# EAGLE design W706 (EAGLE 6.6.0)
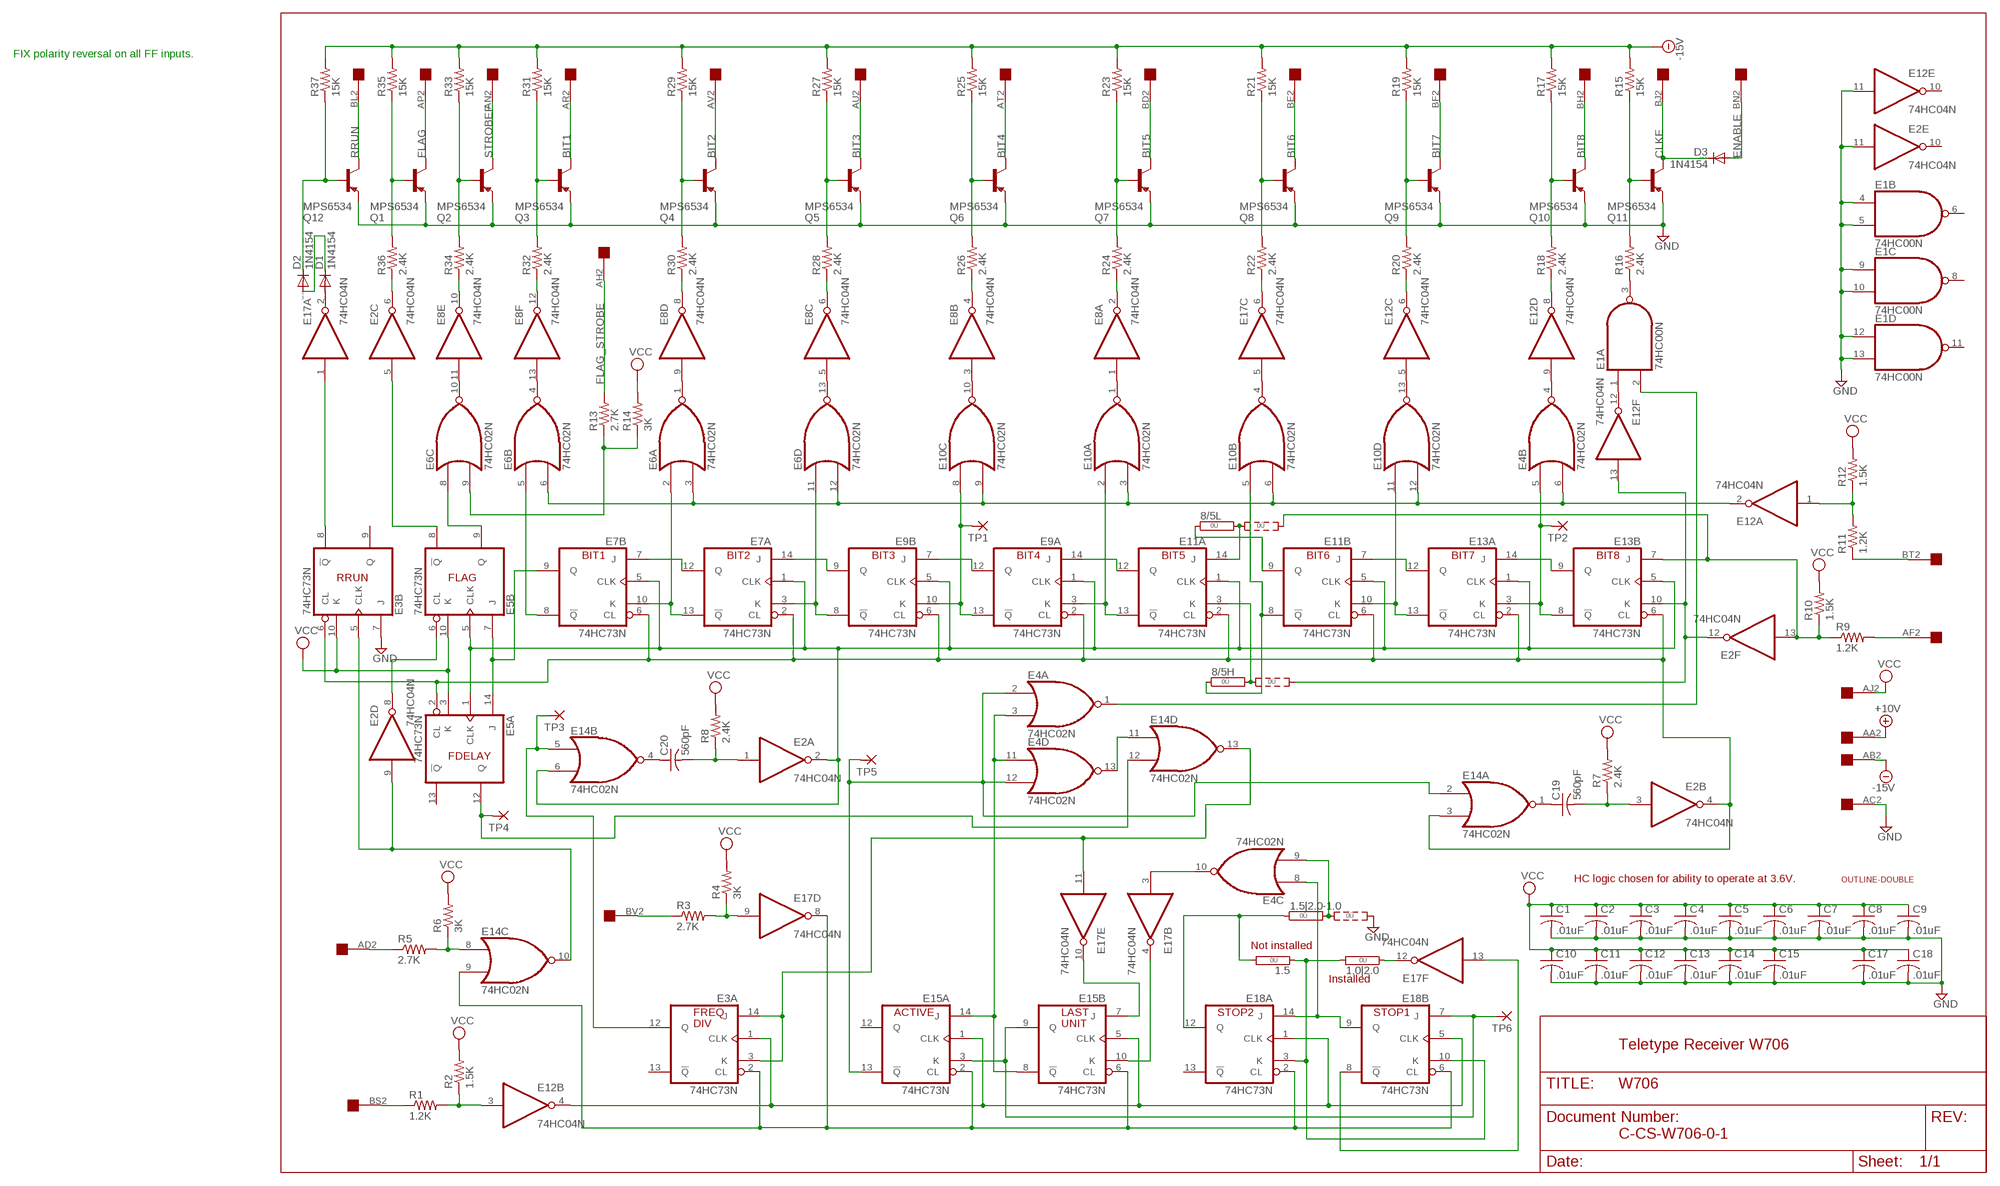
[diagram p0: schematic, sheet 1]

## Parts
1.0|2.0  0R  [0R/10]
1.5  0R  [0R/10]
1.5|2.0-1.0  0R2  [0R2/10]
8/5H  0R2  [0R2/10]
8/5L  0R2  [0R2/10]
C1  .01uF  C-US050-025X075  [C050-025X075]
C2  .01uF  C-US050-025X075  [C050-025X075]
C3  .01uF  C-US050-025X075  [C050-025X075]
C4  .01uF  C-US050-025X075  [C050-025X075]
C5  .01uF  C-US050-025X075  [C050-025X075]
C6  .01uF  C-US050-025X075  [C050-025X075]
C7  .01uF  C-US050-025X075  [C050-025X075]
C8  .01uF  C-US050-025X075  [C050-025X075]
C9  .01uF  C-US050-025X075  [C050-025X075]
C10  .01uF  C-US050-025X075  [C050-025X075]
C11  .01uF  C-US050-025X075  [C050-025X075]
C12  .01uF  C-US050-025X075  [C050-025X075]
C13  .01uF  C-US050-025X075  [C050-025X075]
C14  .01uF  C-US050-025X075  [C050-025X075]
C15  .01uF  C-US050-025X075  [C050-025X075]
C17  .01uF  C-US050-025X075  [C050-025X075]
C18  .01uF  C-US050-025X075  [C050-025X075]
C19  560pF  C-US050-025X075  [C050-025X075]
C20  560pF  C-US050-025X075  [C050-025X075]
D1  1N4154  1N4148DO35-10  [DO35-10]
D2  1N4154  1N4148DO35-10  [DO35-10]
D3  1N4154  1N4148DO35-10  [DO35-10]
E1  74HC00N  74LS00N  [DIL14]
E2  74HC04N  74LS04N  [DIL14]
E3  74HC73N  74LS73N  [DIL14]
E4  74HC02N  74LS02N  [DIL14]
E5  74HC73N  74LS73N  [DIL14]
E6  74HC02N  74LS02N  [DIL14]
E7  74HC73N  74LS73N  [DIL14]
E8  74HC04N  74LS04N  [DIL14]
E9  74HC73N  74LS73N  [DIL14]
E10  74HC02N  74LS02N  [DIL14]
E11  74HC73N  74LS73N  [DIL14]
E12  74HC04N  74LS04N  [DIL14]
E13  74HC73N  74LS73N  [DIL14]
E14  74HC02N  74LS02N  [DIL14]
E15  74HC73N  74LS73N  [DIL14]
E17  74HC04N  74LS04N  [DIL14]
E18  74HC73N  74LS73N  [DIL14]
Q1  MPS6534  2N2904  [TO39]
Q2  MPS6534  2N2904  [TO39]
Q3  MPS6534  2N2904  [TO39]
Q4  MPS6534  2N2904  [TO39]
Q5  MPS6534  2N2904  [TO39]
Q6  MPS6534  2N2904  [TO39]
Q7  MPS6534  2N2904  [TO39]
Q8  MPS6534  2N2904  [TO39]
Q9  MPS6534  2N2904  [TO39]
Q10  MPS6534  2N2904  [TO39]
Q11  MPS6534  2N2904  [TO39]
Q12  MPS6534  2N2904  [TO39]
R1  1.2K  R-US_0207/10  [0207/10]
R2  1.5K  R-US_0207/10  [0207/10]
R3  2.7K  R-US_0207/10  [0207/10]
R4  3K  R-US_0207/10  [0207/10]
R5  2.7K  R-US_0207/10  [0207/10]
R6  3K  R-US_0207/10  [0207/10]
R7  2.4K  R-US_0207/10  [0207/10]
R8  2.4K  R-US_0207/10  [0207/10]
R9  1.2K  R-US_0207/10  [0207/10]
R10  1.5K  R-US_0207/10  [0207/10]
R11  1.2K  R-US_0207/10  [0207/10]
R12  1.5K  R-US_0207/10  [0207/10]
R13  2.7K  R-US_0207/10  [0207/10]
R14  3K  R-US_0207/10  [0207/10]
R15  15K  R-US_0207/10  [0207/10]
R16  2.4K  R-US_0207/10  [0207/10]
R17  15K  R-US_0207/10  [0207/10]
R18  2.4K  R-US_0207/10  [0207/10]
R19  15K  R-US_0207/10  [0207/10]
R20  2.4K  R-US_0207/10  [0207/10]
R21  15K  R-US_0207/10  [0207/10]
R22  2.4K  R-US_0207/10  [0207/10]
R23  15K  R-US_0207/10  [0207/10]
R24  2.4K  R-US_0207/10  [0207/10]
R25  15K  R-US_0207/10  [0207/10]
R26  2.4K  R-US_0207/10  [0207/10]
R27  15K  R-US_0207/10  [0207/10]
R28  2.4K  R-US_0207/10  [0207/10]
R29  15K  R-US_0207/10  [0207/10]
R30  2.4K  R-US_0207/10  [0207/10]
R31  15K  R-US_0207/10  [0207/10]
R32  2.4K  R-US_0207/10  [0207/10]
R33  15K  R-US_0207/10  [0207/10]
R34  2.4K  R-US_0207/10  [0207/10]
R35  15K  R-US_0207/10  [0207/10]
R36  2.4K  R-US_0207/10  [0207/10]
R37  15K  R-US_0207/10  [0207/10]
TP1  3,17/1,3  [3,17/1,3]
TP2  3,17/1,3  [3,17/1,3]
TP3  3,17/1,3  [3,17/1,3]
TP4  3,17/1,3  [3,17/1,3]
TP5  3,17/1,3  [3,17/1,3]
TP6  3,17/1,3  [3,17/1,3]
U$1  OUTLINE-DOUBLE  [DOUBLE]
U$2  DOUBLE  [EDGE-CON4]

## Nets
+10V [Supply]: U$2.AA2
-15V [Supply]: R15.2 R17.2 R19.2 R21.2 R23.2 R25.2 R27.2 R29.2 R31.2 R33.2 R35.2 R37.2 U$2.AB2
BIT1: Q3.3(C) U$2.AR2
BIT2: Q4.3(C) U$2.AV2
BIT3: Q5.3(C) U$2.AU2
BIT4: Q6.3(C) U$2.AT2
BIT5: Q7.3(C) U$2.BD2
BIT6: Q8.3(C) U$2.BE2
BIT7: Q9.3(C) U$2.BF2
BIT8: Q10.3(C) U$2.BH2
CLKE: D3.C Q11.3(C) U$2.BJ2
ENABLE: D3.A U$2.BN2
FLAG: Q1.3(C) U$2.AP2
FLAG_STROBE: R13.2 U$2.AH2
GND [Supply]: 1.5|2.0-1.0.3 C1.2 C2.2 C3.2 C4.2 C5.2 C6.2 C7.2 C8.2 C9.2 C10.2 C11.2 C12.2 C13.2 C14.2 C15.2 C17.2 C18.2 E1.4(B:I0) E1.5(B:I1) E1.9(C:I0) E1.10(C:I1) E1.12(D:I0) E1.13(D:I1) E2.11(E:I) E3.7(B:J) E12.11(E:I) Q1.1(E) Q2.1(E) Q3.1(E) Q4.1(E) Q5.1(E) Q6.1(E) Q7.1(E) Q8.1(E) Q9.1(E) Q10.1(E) Q11.1(E) Q12.1(E) U$2.AC2
N$1: E6.1(A:O) E8.9(D:I)
N$2: E6.4(B:O) E8.13(F:I)
N$3: E6.10(C:O) E8.11(E:I)
N$4: E6.13(D:O) E8.5(C:I)
N$5: E8.1(A:I) E10.1(A:O)
N$6: E10.4(B:O) E17.5(C:I)
N$7: E10.13(D:O) E12.5(C:I)
N$8: E8.3(B:I) E10.10(C:O)
N$9: E4.4(B:O) E12.9(D:I)
N$10: D1.A E17.2(A:O)
N$11: D1.C D2.A
N$12: D2.C Q12.2(B) R37.1
N$13: E1.3(A:O) R16.1
N$14: E12.8(D:O) R18.1
N$15: E12.6(C:O) R20.1
N$16: E17.6(C:O) R22.1
N$17: E8.2(A:O) R24.1
N$18: E8.4(B:O) R26.1
N$19: E8.6(C:O) R28.1
N$20: E8.8(D:O) R30.1
N$21: E8.12(F:O) R32.1
N$22: E2.6(C:O) R36.1
N$23: Q1.2(B) R35.1 R36.2
N$24: E8.10(E:O) R34.1
N$25: Q2.2(B) R33.1 R34.2
N$26: Q3.2(B) R31.1 R32.2
N$27: Q4.2(B) R29.1 R30.2
N$28: Q5.2(B) R27.1 R28.2
N$29: Q6.2(B) R25.1 R26.2
N$30: Q7.2(B) R23.1 R24.2
N$31: Q8.2(B) R21.1 R22.2
N$32: Q9.2(B) R19.1 R20.2
N$33: Q10.2(B) R17.1 R18.2
N$34: Q11.2(B) R15.1 R16.2
N$35: E3.8(B:!Q) E17.1(A:I)
N$36: E2.5(C:I) E5.8(B:!Q)
N$37: E5.9(B:Q) E6.8(C:I0)
N$38: E7.7(B:J) E7.12(A:Q)
N$39: E6.2(A:I0) E7.10(B:K) E7.13(A:!Q)
N$40: E2.2(A:O) E5.1(A:CLK) E5.5(B:CLK) E7.1(A:CLK) E7.5(B:CLK) E9.1(A:CLK) E9.5(B:CLK) E11.1(A:CLK) E11.5(B:CLK) E13.1(A:CLK) E13.5(B:CLK) E14.6(B:I1)
N$41: E2.4(B:O) E3.6(B:CL) E5.2(A:CL) E7.2(A:CL) E7.6(B:CL) E9.2(A:CL) E9.6(B:CL) E11.2(A:CL) E11.6(B:CL) E13.2(A:CL) E13.6(B:CL) E14.3(A:I1)
N$42: E6.11(D:I0) E7.3(A:K) E9.8(B:!Q)
N$43: E7.14(A:J) E9.9(B:Q)
N$44: E9.10(B:K) E9.13(A:!Q) E10.8(C:I0) TP1.1(P)
N$45: E9.7(B:J) E9.12(A:Q)
N$46: E10.11(D:I0) E11.10(B:K) E13.13(A:!Q)
N$47: E11.7(B:J) E13.12(A:Q)
N$48: E9.3(A:K) E10.2(A:I0) E11.13(A:!Q)
N$49: E9.14(A:J) E11.12(A:Q)
N$50: 8/5H.1 E10.5(B:I0) E11.8(B:!Q)
N$51: 8/5L.1 E11.9(B:Q)
N$52: E4.5(B:I0) E13.3(A:K) E13.8(B:!Q) TP2.1(P)
N$53: E13.9(B:Q) E13.14(A:J)
N$54: R1.1 U$2.BS2
N$55: E4.6(B:I1) E6.3(A:I1) E6.6(B:I1) E6.12(D:I1) E10.3(A:I1) E10.6(B:I1) E10.9(C:I1) E10.12(D:I1) E12.2(A:O)
N$56: E6.5(B:I0) E7.8(B:!Q)
N$57: E12.3(B:I) R1.2 R2.1
N$58: R11.1 U$2.BT2
N$59: E12.1(A:I) R11.2 R12.1
N$60: E4.3(A:I1) E4.11(D:I0) E15.8(B:!Q) E15.14(A:J)
N$61: E2.9(D:I) E3.5(B:CLK) E14.10(C:O)
N$62: E4.8(C:I0) E18.9(B:Q) E18.14(A:J)
N$63: E15.3(A:K) E15.9(B:Q) E18.7(B:J) TP6.1(P)
N$64: E1.2(A:I1) E4.1(A:O)
N$65: 8/5L.3 E2.13(F:I) E13.7(B:J) R9.1 R10.1
N$66: 8/5H.2 E11.3(A:K)
N$67: 8/5L.2 E11.14(A:J)
N$68: E14.8(C:I0) R5.2 R6.1
N$69: R9.2 U$2.AF2
N$70: 8/5H.3 E2.12(F:O) E12.13(F:I) E13.10(B:K)
N$71: E6.9(C:I1) R13.1 R14.1
N$72: R5.1 U$2.AD2
N$73: E4.2(A:I0) E4.12(D:I1) E14.2(A:I0) E15.13(A:!Q) TP5.1(P)
N$74: E2.8(D:O) E5.6(B:CL)
N$75: E3.1(A:CLK) E12.4(B:O) E15.1(A:CLK) E15.5(B:CLK) E18.1(A:CLK) E18.5(B:CLK)
N$76: 1.5|2.0-1.0.2 E4.9(C:I1)
N$77: E17.9(D:I) R3.2 R4.1
N$78: R3.1 U$2.BV2
N$79: E4.10(C:O) E17.3(B:I)
N$80: E3.2(A:CL) E14.9(C:I1) E15.2(A:CL) E15.6(B:CL) E17.8(D:O) E18.2(A:CL) E18.6(B:CL)
N$81: 1.0|2.0.2 1.5.1 E18.3(A:K) E18.10(B:K)
N$82: 1.5.2 1.5|2.0-1.0.1 E18.12(A:Q)
N$83: E15.10(B:K) E17.4(B:O)
N$84: E4.13(D:O) E14.11(D:I0)
N$85: C20.2 E2.1(A:I) R8.1
N$86: C19.2 E2.3(B:I) R7.1
N$87: C20.1 E14.4(B:O)
N$88: C19.1 E14.1(A:O)
N$89: 1.0|2.0.1 E17.12(F:O)
N$90: E17.13(F:I) E18.8(B:!Q)
N$91: E3.12(A:Q) E14.5(B:I0) TP3.1(P)
N$92: E5.7(B:J) E5.14(A:J) E7.9(B:Q)
N$93: E15.7(B:J) E17.10(E:O)
N$94: E5.12(A:Q) E14.12(D:I1) TP4.1(P)
N$95: E3.3(A:K) E3.14(A:J) E14.13(D:O) E17.11(E:I)
N$96: E1.1(A:I0) E12.12(F:O)
RRUN: Q12.3(C) U$2.BL2
STROBEF: Q2.3(C) U$2.AN2
VCC [Supply]: C1.1 C2.1 C3.1 C4.1 C5.1 C6.1 C7.1 C8.1 C9.1 C10.1 C11.1 C12.1 C13.1 C14.1 C15.1 C17.1 C18.1 E3.10(B:K) E5.3(A:K) E5.10(B:K) R2.2 R4.2 R6.2 R7.2 R8.2 R10.2 R12.2 R14.2 U$2.AJ2
Unconnected: E1.6(B:O) E1.8(C:O) E1.11(D:O) E2.10(E:O) E3.9(B:Q) E3.13(A:!Q) E5.13(A:!Q) E12.10(E:O) E15.12(A:Q) E18.13(A:!Q) U$2.AA1 U$2.AB1 U$2.AC1 U$2.AD1 U$2.AE1 U$2.AE2 U$2.AF1 U$2.AH1 U$2.AJ1 U$2.AK1 U$2.AK2 U$2.AL1 U$2.AL2 U$2.AM1 U$2.AM2 U$2.AN1 U$2.AP1 U$2.AR1 U$2.AS1 U$2.AS2 U$2.AT1 U$2.AU1 U$2.AV1 U$2.BA1 U$2.BA2 U$2.BB1 U$2.BB2 U$2.BC1 U$2.BC2 U$2.BD1 U$2.BE1 U$2.BF1 U$2.BH1 U$2.BJ1 U$2.BK1 U$2.BK2 U$2.BL1 U$2.BM1 U$2.BM2 U$2.BN1 U$2.BP1 U$2.BP2 U$2.BR1 U$2.BR2 U$2.BS1 U$2.BT1 U$2.BU1 U$2.BU2 U$2.BV1

## Notes on the sheet
- FIX polarity reversal on all FF inputs.
- BIT1 | BIT2 | BIT3 | BIT4 | BIT5 | BIT6 | BIT7 | BIT8
- RRUN | FLAG
- FDELAY
- HC logic chosen for ability to operate at 3.6V.
- Not installed
- Installed
- FREQ | ACTIVE | LAST | STOP2 | STOP1
- DIV | UNIT
- Teletype Receiver W706
- C-CS-W706-0-1

## Power pins joined to a net without a drawn wire
GND: E1.7(P:GND) E2.7(P:GND) E3.11(P:GND) E4.7(P:GND) E5.11(P:GND) E6.7(P:GND) E7.11(P:GND) E8.7(P:GND) E9.11(P:GND) E10.7(P:GND) E11.11(P:GND) E12.7(P:GND) E13.11(P:GND) E14.7(P:GND) E15.11(P:GND) E17.7(P:GND) E18.11(P:GND)
VCC: E1.14(P:VCC) E2.14(P:VCC) E3.4(P:VCC) E4.14(P:VCC) E5.4(P:VCC) E6.14(P:VCC) E7.4(P:VCC) E8.14(P:VCC) E9.4(P:VCC) E10.14(P:VCC) E11.4(P:VCC) E12.14(P:VCC) E13.4(P:VCC) E14.14(P:VCC) E15.4(P:VCC) E17.14(P:VCC) E18.4(P:VCC)

## Library data of the parts
1.0|2.0 1.5 = jumper:0R: Bridge 0R 10mm
1.5|2.0-1.0 8/5H 8/5L = jumper:0R2: Bridge switch 0R 2 x 10mm
C1-C15 C17-C20 = rcl:C-US: CAPACITOR, American symbol
D1-D3 = diode:1N4148: DIODE high speed (Philips)
E1 = 74xx-us:74*00: Quad 2-input NAND gate
E2 E8 E12 E17 = 74xx-us:74*04: Hex INVERTER
E3 E5 E7 E9 E11 E13 E15 E18 = 74xx-us:74*73: Dual J-K FLIP FLOP, clear
E4 E6 E10 E14 = 74xx-us:74*02: Quad 2-input NOR gate
Q1-Q12 = transistor-pnp:2N2904*: PNP Transistror
R1-R37 = rcl:R-US_: RESISTOR, American symbol
TP1-TP6 = wirepad:3,17/1,3: THROUGH-HOLE PAD
U$1 = dec-con:OUTLINE-*: Board outlines for DEC boards.
U$2 = dec-con:DOUBLE: Double-Height DEC board

## Net classes
1 Supply: width 0.813 mm

## Board
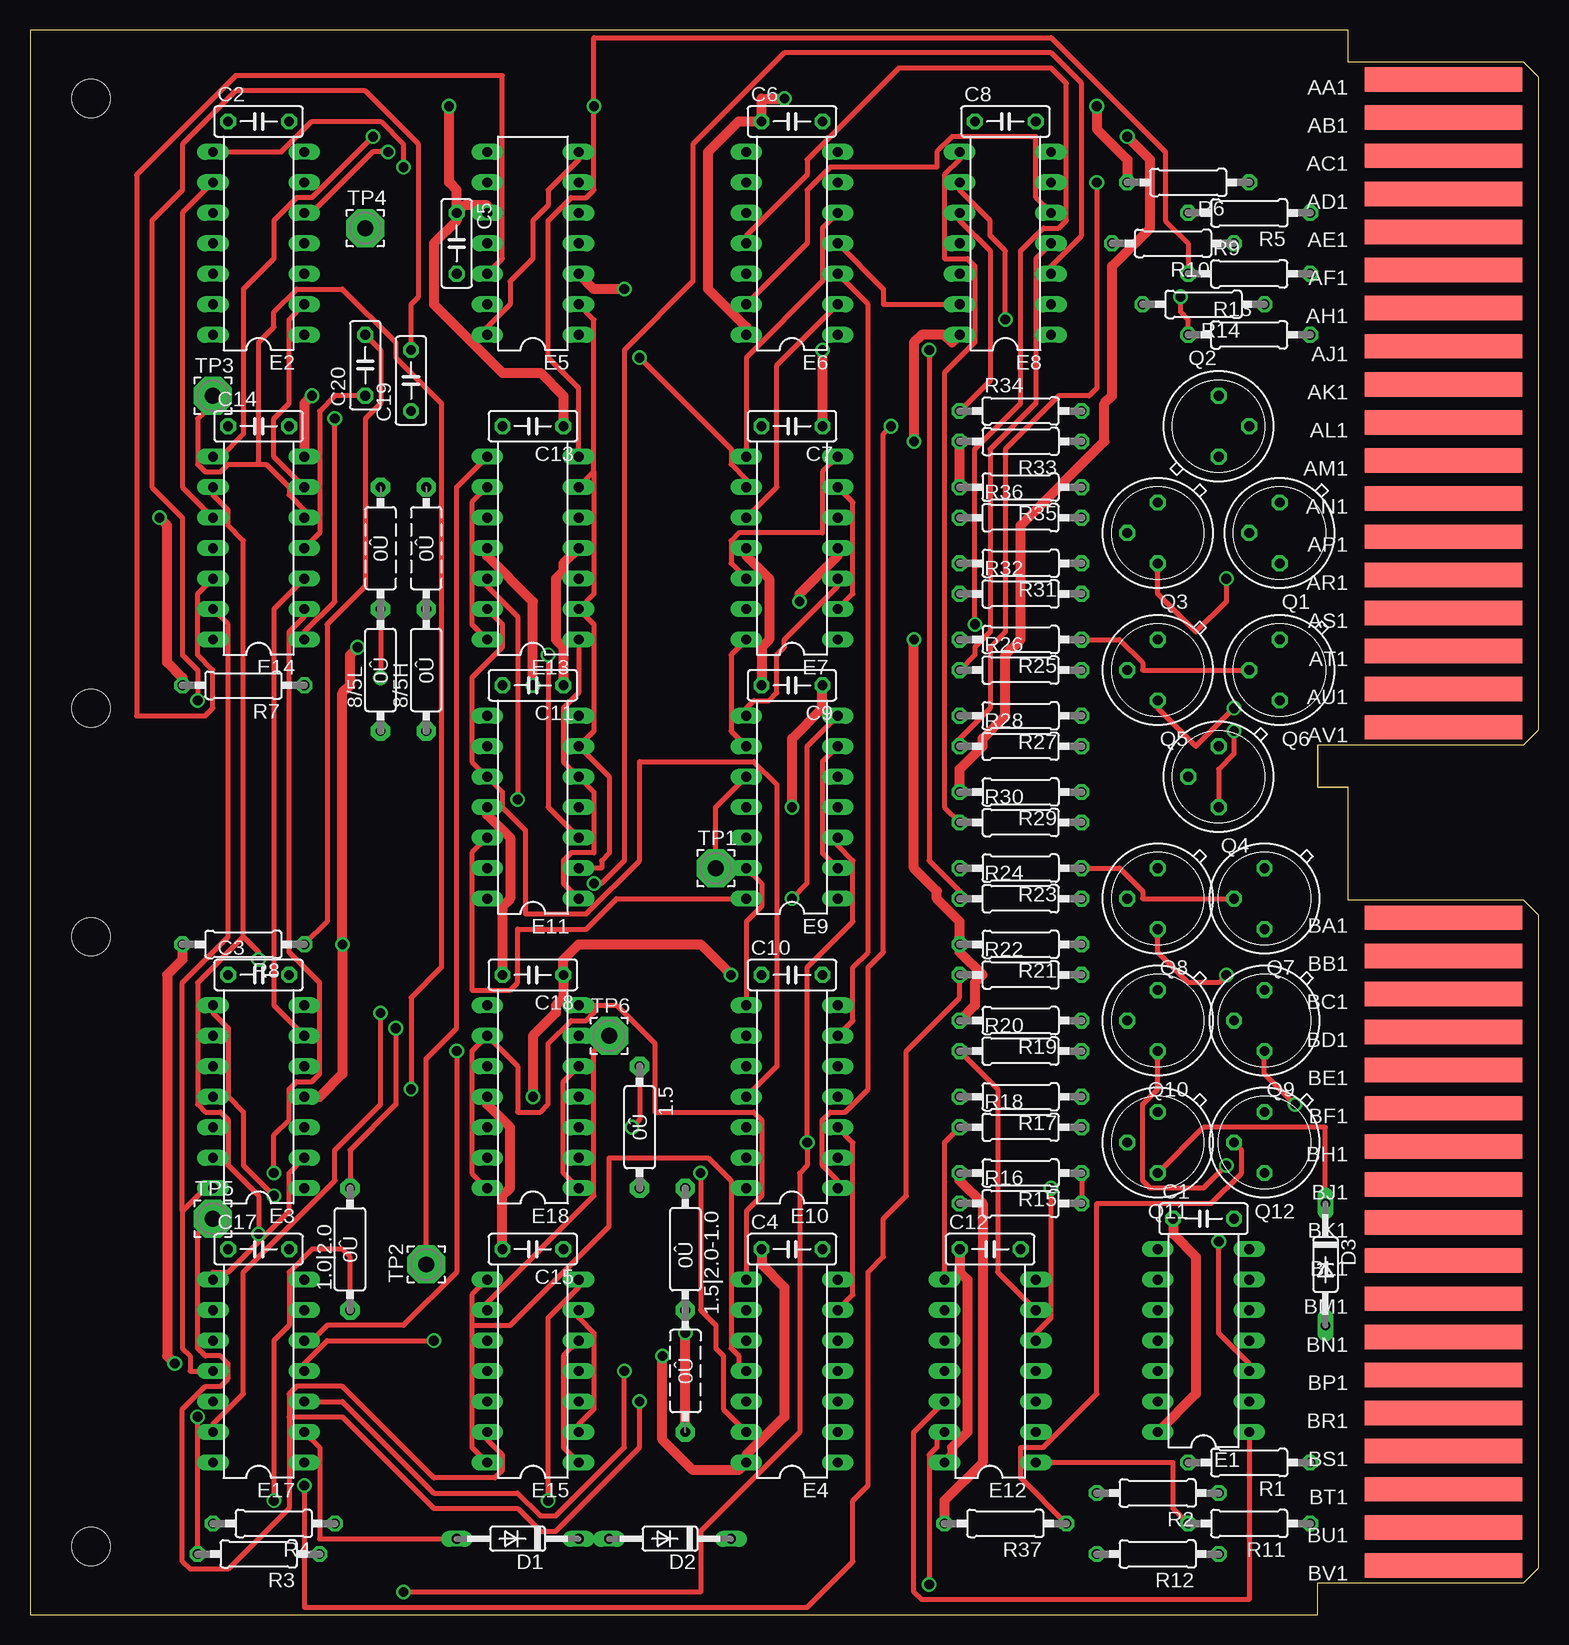
[diagram p1: board, top side]
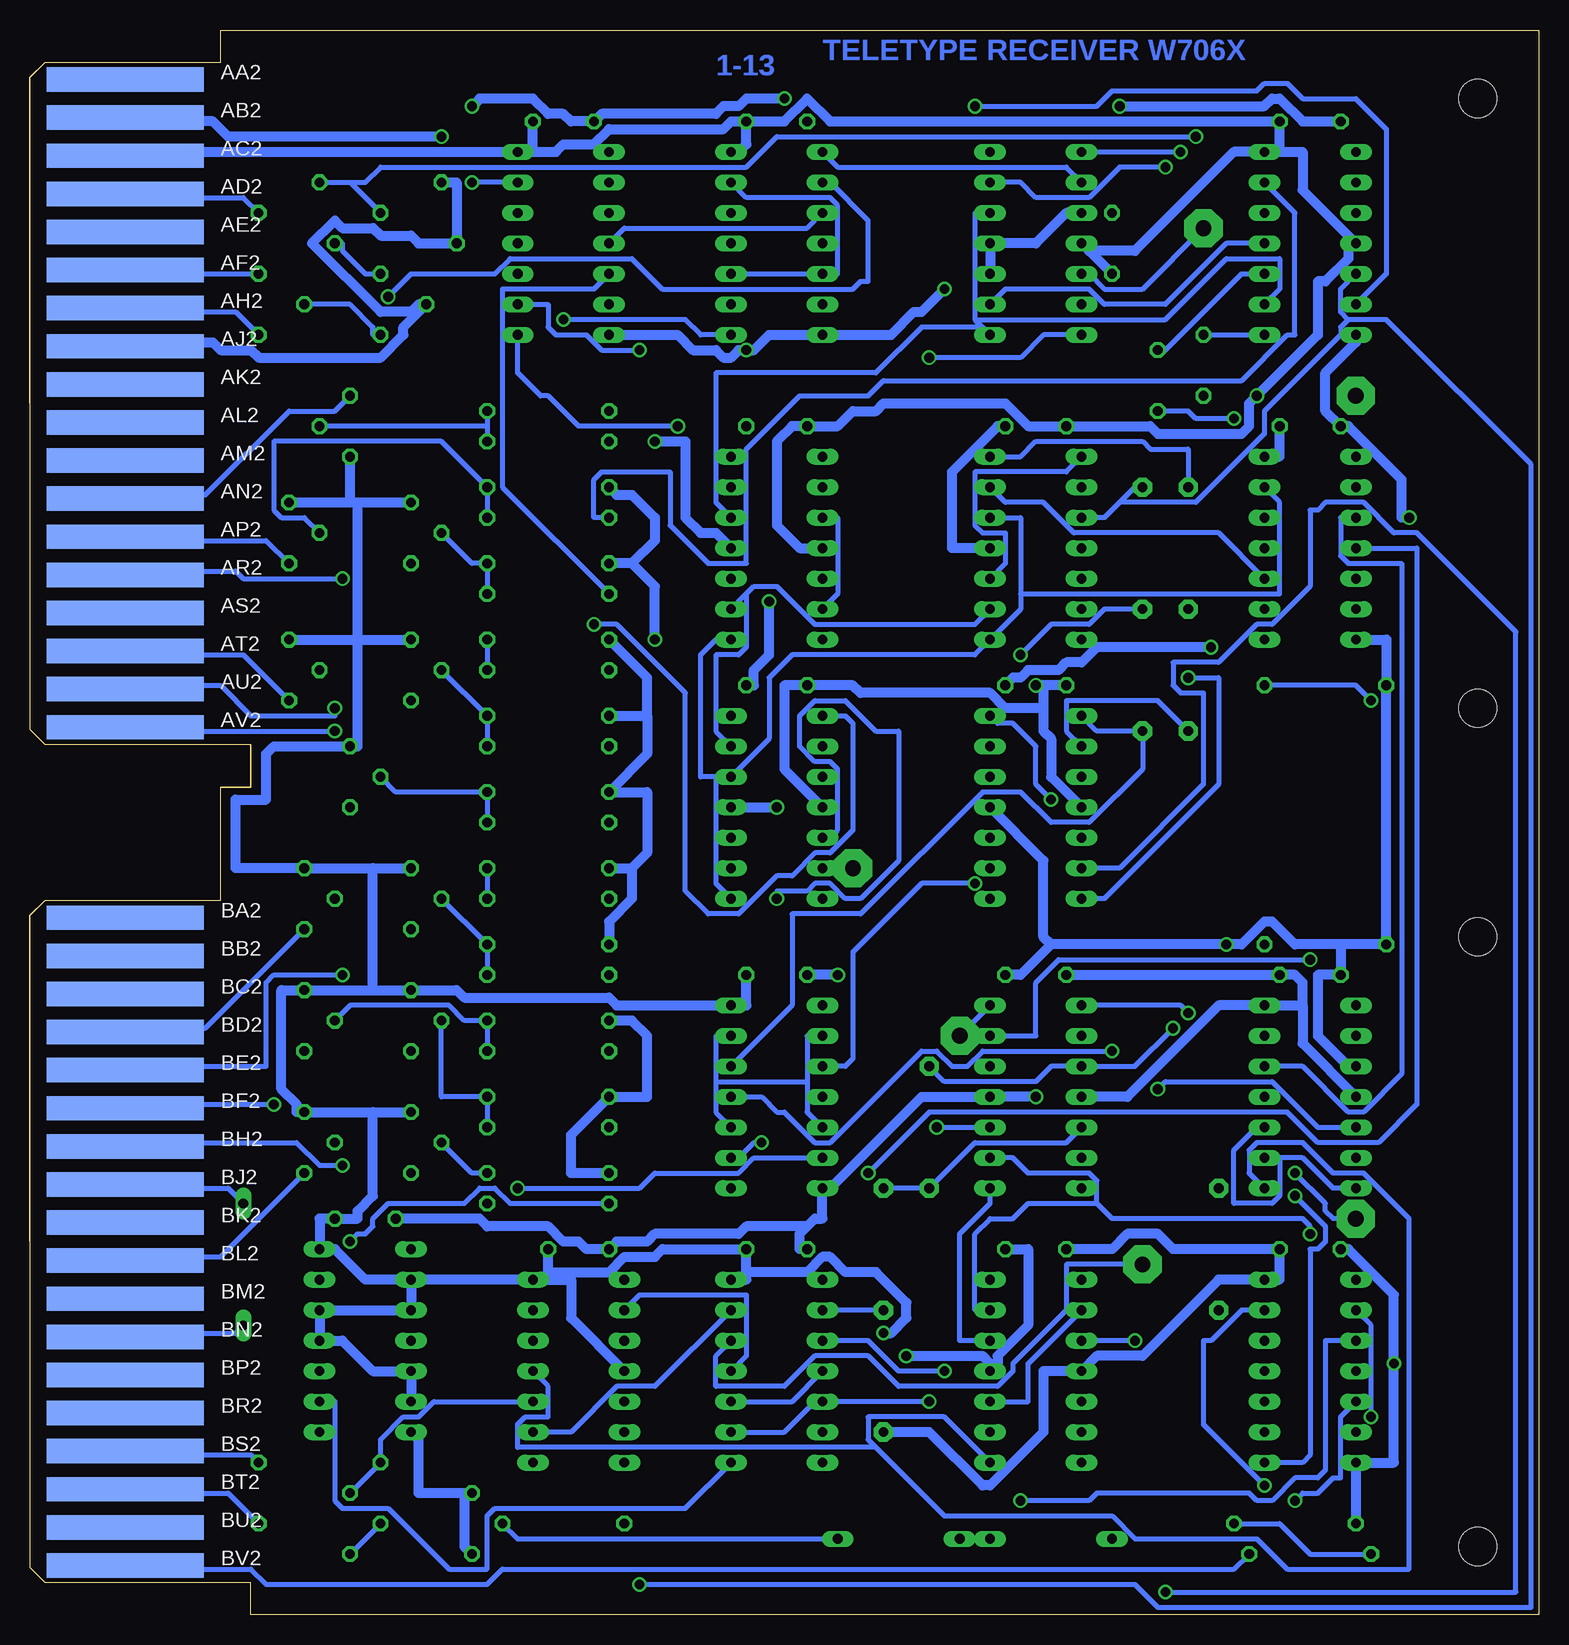
[diagram p2: board, bottom side, seen from below]

Size 125.73 x 132.08 mm. Coordinates in mm from the lower left corner, seen from the top.
Copper layers (1+16): Top 0.035mm / dielectric 1.5mm / Bottom 0.035mm
Design rules "16mils": minimum track width 16mil, minimum drill 32mil, track to track 15mil, track to pad 10mil, pad to pad 10mil, via to via 10mil, smd to smd 10mil, copper to edge 13mil, drill to drill 10mil, minimum pad ring 10mil, minimum via ring 8mil, stop-mask expansion 0mil, vias tented up to drill 0mil, thermal gap 10mil

### Footprints (pad centres in the part's own frame; a part is rotated, then mirrored left to right if it is on the bottom)
0R/10 = drill 0.813 pad 1.6 octagon: 1 -5.08,0; 2 5.08,0
0R2/10 = drill 0.813 pad 1.6 octagon: 1 -5.08,0; 2 5.08,0; 3 15.24,0
C050-025X075 = drill 0.813 octagon: 1 -2.54,0; 2 2.54,0
DO35-10 = drill 0.813 long: A 5.08,0; C -5.08,0
DIL14 = drill 0.813 long: 1 -7.62,-3.81; 2 -5.08,-3.81; 3 -2.54,-3.81; 4 0,-3.81; 5 2.54,-3.81; 6 5.08,-3.81; 7 7.62,-3.81; 8 7.62,3.81; 9 5.08,3.81; 10 2.54,3.81; 11 0,3.81; 12 -2.54,3.81; 13 -5.08,3.81; 14 -7.62,3.81
TO39 = drill 0.813 octagon: 1 0,-2.54; 2 2.54,0; 3 0,2.54
0207/10 = drill 0.813 octagon: 1 -5.08,0; 2 5.08,0
3,17/1,3 = drill 1.321 pad 3.175 octagon: 1 0,0
DOUBLE = hole 3.175: 120.65,56.515; 120.65,5.715; 120.65,75.565; 120.65,126.365
EDGE-CON4 = smd 13.106 x 2.032: AA1 7.938,4.128; AB1 7.938,7.303; AC1 7.938,10.477; AD1 7.938,13.652; AE1 7.938,16.828; AF1 7.938,20.003; AH1 7.938,23.177; AJ1 7.938,26.352; AK1 7.938,29.527; AL1 7.938,32.703; AM1 7.938,35.877; AN1 7.938,39.053; AP1 7.938,42.227; AR1 7.938,45.403; AS1 7.938,48.578; AT1 7.938,51.752; AU1 7.938,54.928; AV1 7.938,58.102; BA1 7.938,73.978; BB1 7.938,77.153; BC1 7.938,80.328; BD1 7.938,83.502; BE1 7.938,86.677; BF1 7.938,89.853; BH1 7.938,93.028; BJ1 7.938,96.203; BK1 7.938,99.377; BL1 7.938,102.552; BM1 7.938,105.728; BN1 7.938,108.903; BP1 7.938,112.078; BR1 7.938,115.252; BS1 7.938,118.427; BT1 7.938,121.603; BU1 7.938,124.778; BV1 7.938,127.953 | smd 13.106 x 2.032 bottom: AA2 7.938,4.128; AB2 7.938,7.303; AC2 7.938,10.477; AD2 7.938,13.652; AE2 7.938,16.828; AF2 7.938,20.003; AH2 7.938,23.177; AJ2 7.938,26.352; AK2 7.938,29.527; AL2 7.938,32.703; AM2 7.938,35.877; AN2 7.938,39.053; AP2 7.938,42.227; AR2 7.938,45.403; AS2 7.938,48.578; AT2 7.938,51.752; AU2 7.938,54.928; AV2 7.938,58.102; BA2 7.938,73.978; BB2 7.938,77.153; BC2 7.938,80.328; BD2 7.938,83.502; BE2 7.938,86.677; BF2 7.938,89.853; BH2 7.938,93.028; BJ2 7.938,96.203; BK2 7.938,99.377; BL2 7.938,102.552; BM2 7.938,105.728; BN2 7.938,108.903; BP2 7.938,112.078; BR2 7.938,115.252; BS2 7.938,118.427; BT2 7.938,121.603; BU2 7.938,124.778; BV2 7.938,127.953

### Placement (x,y rotation side)
1.0|2.0  26.67,30.48 90 top
1.5  50.8,40.64 270 top
1.5|2.0-1.0  54.61,30.48 270 top
8/5H  33.02,78.74 90 top
8/5L  29.21,78.74 90 top
C1  97.79,33.02 0 top
C2  19.05,124.46 0 top
C3  19.05,53.34 0 top
C4  63.5,30.48 0 top
C5  35.56,114.3 270 top
C6  63.5,124.46 0 top
C7  63.5,99.06 180 top
C8  81.28,124.46 0 top
C9  63.5,77.47 180 top
C10  63.5,53.34 0 top
C11  41.91,77.47 180 top
C12  80.01,30.48 0 top
C13  41.91,99.06 180 top
C14  19.05,99.06 0 top
C15  41.91,30.48 180 top
C17  19.05,30.48 0 top
C18  41.91,53.34 180 top
C19  31.75,102.87 90 top
C20  27.94,104.14 90 top
D1  40.64,6.35 180 top
D2  53.34,6.35 180 top
D3  107.95,29.21 270 top
E1  97.79,22.86 90 top
E2  19.05,114.3 90 top
E3  19.05,43.18 90 top
E4  63.5,20.32 90 top
E5  41.91,114.3 90 top
E6  63.5,114.3 90 top
E7  63.5,88.9 90 top
E8  81.28,114.3 90 top
E9  63.5,67.31 90 top
E10  63.5,43.18 90 top
E11  41.91,67.31 90 top
E12  80.01,20.32 90 top
E13  41.91,88.9 90 top
E14  19.05,88.9 90 top
E15  41.91,20.32 90 top
E17  19.05,20.32 90 top
E18  41.91,43.18 90 top
Q1  104.14,90.17 180 top
Q2  99.06,99.06 0 top
Q3  93.98,90.17 180 top
Q4  99.06,69.85 180 top
Q5  93.98,78.74 180 top
Q6  104.14,78.74 180 top
Q7  102.87,59.69 180 top
Q8  93.98,59.69 180 top
Q9  102.87,49.53 180 top
Q10  93.98,49.53 180 top
Q11  93.98,39.37 180 top
Q12  102.87,39.37 180 top
R1  101.6,12.7 180 top
R2  93.98,10.16 180 top
R3  19.05,5.08 180 top
R4  20.32,7.62 180 top
R5  101.6,116.84 180 top
R6  96.52,119.38 180 top
R7  17.78,77.47 180 top
R8  17.78,55.88 180 top
R9  101.6,111.76 0 top
R10  95.25,114.3 180 top
R11  101.6,7.62 180 top
R12  93.98,5.08 180 top
R13  101.6,106.68 0 top
R14  97.79,109.22 180 top
R15  82.55,36.83 180 top
R16  82.55,34.29 0 top
R17  82.55,43.18 180 top
R18  82.55,40.64 0 top
R19  82.55,49.53 180 top
R20  82.55,46.99 0 top
R21  82.55,55.88 180 top
R22  82.55,53.34 0 top
R23  82.55,62.23 180 top
R24  82.55,59.69 0 top
R25  82.55,81.28 180 top
R26  82.55,78.74 0 top
R27  82.55,74.93 180 top
R28  82.55,72.39 0 top
R29  82.55,68.58 180 top
R30  82.55,66.04 0 top
R31  82.55,87.63 180 top
R32  82.55,85.09 0 top
R33  82.55,97.79 180 top
R34  82.55,100.33 0 top
R35  82.55,93.98 180 top
R36  82.55,91.44 0 top
R37  81.28,7.62 180 top
TP1  57.15,62.23 0 top
TP2  33.02,29.21 90 top
TP3  15.24,101.6 0 top
TP4  27.94,115.57 0 top
TP5  15.24,33.02 0 top
TP6  48.26,48.26 0 top
U$1  125.73,132.08 180 top
U$2  125.73,132.08 180 top

### Tracks (layer width: path | path; a pad name or v marks a point on that pad's centre or on a via)
-15V  (via drill 0.81)
  Top 0.813: R37.2 76.2,9.53 79.38,12.7 79.38,34.29 77.47,36.2 R15.2 | R35.2 R33.2 | v73.66,81.28 73.66,62.23 75.56,60.33 75.56,59.69 77.47,57.78 R21.2 77.47,55.24 79.38,53.34 78.74,52.7 78.74,50.8 R19.2 | v91.44,123.19 93.34,121.28 93.34,115.57 90.17,112.39 90.17,101.6 89.53,100.97 89.53,97.79 82.55,90.81 82.55,81.28 81.28,80.01 81.28,74.93 79.38,73.03 79.38,72.39 77.47,70.48 R29.2
  Bottom 0.813: R15.2 80.64,36.83 80.64,40.01 R17.2 74.3,43.18 74.3,48.26 75.56,49.53 R19.2 | 75.56,87.63 R31.2 | 75.56,87.63 73.66,89.53 73.66,91.44 75.56,93.34 76.83,93.34 R35.2 | R21.2 77.47,57.78 75.56,59.69 75.56,62.23 | R23.2 75.56,62.23 | R25.2 74.3,78.11 74.3,74.93 | R27.2 74.3,74.93 | 74.3,74.93 74.3,71.75 R29.2 74.3,68.58 74.3,63.5 75.56,62.23 | 75.56,87.63 73.66,85.72 v73.66,81.28 | v91.44,123.19 109.22,123.19 110.49,124.46 117.47,124.46 U$2.AB2
BIT1  (via drill 0.81)
  Top 0.406: Q3.3 93.98,85.09 97.16,81.92 99.69,84.45 v99.69,86.36
  Bottom 0.406: v99.69,86.36 107.95,86.36 108.58,87 117.47,87 U$2.AR2
BIT2  (via drill 0.81)
  Top 0.406: Q4.3 99.06,70.48 100.33,71.75 v100.33,73.66
  Bottom 0.406: v100.33,73.66 117.47,73.66 U$2.AV2
BIT3  (via drill 0.81)
  Top 0.406: Q5.3 93.98,75.56 97.16,72.39 v100.33,75.56
  Bottom 0.406: v100.33,75.56 100.33,74.93 107.31,74.93 109.86,77.47 117.47,77.47 U$2.AU2
BIT4
  Bottom 0.406: Q6.3 107.95,80.01 117.47,80.01 U$2.AT2
BIT5
  Bottom 0.406: Q7.3 111.12,48.9 117.47,48.9 U$2.BD2
BIT6  (via drill 0.81)
  Top 0.406: Q8.3 93.98,55.24 96.52,52.7 99.06,52.7 v99.69,53.34
  Bottom 0.406: v99.69,53.34 105.41,53.34 106.05,52.7 106.05,45.72 117.47,45.72 U$2.BE2
BIT7  (via drill 0.81)
  Top 0.406: Q9.3 102.87,45.09 v105.41,42.55
  Bottom 0.406: v105.41,42.55 117.47,42.55 U$2.BF2
BIT8  (via drill 0.81)
  Top 0.406: Q10.3 93.98,43.81 92.71,42.55 92.71,36.2 93.34,35.56 97.79,35.56 v99.69,37.47
  Bottom 0.406: v99.69,37.47 101.6,37.47 103.5,39.37 117.47,39.37 U$2.BH2
CLKE
  Top 0.406: Q11.3 97.79,40.64 107.95,40.64 D3.C
  Bottom 0.406: D3.C 109.22,35.56 117.47,35.56 U$2.BJ2
ENABLE
  Bottom 0.406: D3.A 108.58,23.5 117.47,23.5 U$2.BN2
FLAG
  Bottom 0.406: Q1.3 106.05,89.53 117.47,89.53 U$2.AP2
FLAG_STROBE
  Bottom 0.406: R13.2 108.58,108.58 117.47,108.58 U$2.AH2
GND  (via drill 0.81)
  Top 0.813: E18.11 38.1,42.55 40.01,40.64 40.01,35.56 39.37,34.92 C15.2 | E13.11 38.1,88.27 41.91,84.45 v41.91,77.47 | E14.7 22.86,100.97 v23.5,101.6 | C9.2 60.96,80.64 61.59,81.28 61.59,86.36 59.69,88.27 E7.11 | C18.2 39.37,59.05 40.01,59.69 40.01,64.77 38.1,66.67 E11.11 | 1.5|2.0-1.0.3 v54.61,23.5
  Bottom 0.813: Q1.1 99.06,92.71 | 99.06,92.71 98.42,92.71 | 98.42,92.71 Q3.1 | 99.06,92.71 Q2.1 | Q6.1 98.42,81.28 | 98.42,81.28 Q5.1 | 97.16,62.23 Q7.1 108.58,62.23 108.58,67.94 106.05,67.94 106.05,71.75 105.41,72.39 Q4.1 98.42,72.39 98.42,81.28 | 97.16,62.23 Q8.1 | 98.42,81.28 98.42,92.71 | C10.2 66.04,50.8 E10.7 76.83,50.8 77.47,51.44 89.53,51.44 90.17,52.07 Q10.1 97.16,52.07 | 97.16,52.07 Q9.1 104.78,52.07 104.78,43.81 103.5,42.55 103.5,41.91 Q12.1 97.16,41.91 | E1.13 E1.12 97.16,20.32 99.69,22.86 E1.4 E1.5 E1.10 E1.9 | 97.16,41.91 Q11.1 | 66.04,28.57 66.04,27.94 E4.7 | 66.04,28.57 C4.2 73.03,30.48 73.66,29.84 76.2,29.84 77.47,28.57 82.55,28.57 | E12.11 80.64,24.77 80.64,27.94 82.55,27.94 | 82.55,27.94 E12.7 E1.9 | 82.55,27.94 82.55,28.57 | 82.55,28.57 C12.2 | E1.9 97.79,27.94 100.33,30.48 E1.7 101.6,33.02 C1.2 98.42,33.02 98.42,33.66 97.16,34.92 97.16,41.91 | 97.16,52.07 97.16,62.23 | C18.2 C3.2 20.32,53.34 19.68,52.7 19.68,50.8 | E3.11 19.68,47.62 19.68,50.8 | 19.68,50.8 E3.7 26.67,50.8 34.29,43.18 E18.11 | C15.2 35.56,30.48 34.29,31.75 31.75,31.75 30.48,30.48 C17.2 21.59,27.94 E17.7 26.67,27.94 33.02,21.59 36.83,21.59 E15.11 41.27,20.32 41.27,15.24 45.72,10.79 46.35,10.79 50.8,15.24 1.5|2.0-1.0.3 | E9.11 62.87,70.48 62.87,77.47 C9.2 57.15,77.47 56.52,76.83 45.72,76.83 44.45,75.56 41.27,75.56 | E11.11 40.64,69.85 40.64,73.03 41.27,73.66 41.27,75.56 | 41.27,77.47 41.27,75.56 | C11.2 41.27,77.47 | 41.27,77.47 v41.91,77.47 | C14.2 21.59,96.52 E14.7 | E7.11 61.59,88.9 63.5,90.81 63.5,97.79 62.23,99.06 C7.2 58.42,99.06 57.15,100.33 55.24,100.33 54.61,100.97 44.45,100.97 42.55,99.06 C13.2 32.38,99.06 31.75,98.42 24.77,98.42 24.13,99.06 24.13,100.97 v23.5,101.6 18.41,106.68 18.41,111.12 17.78,111.12 15.88,113.03 15.88,114.3 E2.11 19.68,118.75 19.68,121.92 21.59,121.92
  Bottom 0.813: E5.11 37.47,113.67 | 37.47,113.67 C5.2 | 21.59,121.92 E2.7 25.4,121.92 33.66,113.67 37.47,113.67 | 21.59,121.92 C2.2 59.05,124.46 60.96,126.36 62.87,124.46 C6.2 | C6.2 66.04,122.56 66.67,121.92 E6.7 | 83.82,121.92 C8.2 | 83.82,121.92 E8.7 117.47,121.92 U$2.AC2 | C6.2 67.31,124.46 67.94,123.83 77.47,123.83 78.74,122.56 81.28,122.56 81.92,121.92 83.82,121.92 | 66.04,28.57 60.96,28.57 59.69,29.84 59.05,29.84 57.78,28.57 55.24,28.57 52.7,26.04 52.7,24.77 53.98,23.5 v54.61,23.5
N$1  (via drill 0.81)
  Top 0.406: E8.9 77.47,118.75 80.01,116.2 80.01,114.94 81.28,113.67 v81.28,107.95
  Bottom 0.406: v81.28,107.95 71.12,107.95 69.85,106.68 E6.1
N$2
  Top 0.406: E8.13 71.12,109.22 71.12,110.49 E6.4
N$3
  Bottom 0.406: E6.10 60.96,115.57 76.2,115.57 E8.11
N$4
  Top 0.406: E6.13 64.77,114.3 64.77,118.75 66.67,120.65 75.56,120.65 75.56,121.92 76.83,123.19 83.82,123.19 83.82,118.11 E8.5
N$5  (via drill 0.81)
  Top 0.406: v71.75,99.06 71.12,98.42 71.12,55.24 69.85,53.98 69.85,43.81 67.94,41.91 66.67,41.91 66.04,41.27 66.04,37.47 67.31,36.2 E10.1
  Bottom 0.406: E8.1 85.09,103.5 83.19,101.6 82.55,101.6 80.01,99.06 v71.75,99.06
N$6  (via drill 0.81)
  Top 0.406: E17.5 23.5,22.86 24.77,24.13 31.11,24.13 35.56,28.57 v35.56,46.99
  Bottom 0.406: v35.56,46.99 46.35,46.99 47.62,45.72 48.9,45.72 50.16,46.99 51.44,46.99 59.05,39.37 60.33,39.37 62.87,41.91 63.5,41.91 64.77,43.18 E10.4
N$7  (via drill 0.81)
  Top 0.406: v85.09,35.56 85.09,24.77 83.82,23.5 E12.5
  Bottom 0.406: E10.13 65.41,38.1 66.67,36.83 73.66,36.83 74.93,35.56 v85.09,35.56
N$8  (via drill 0.81)
  Top 0.406: v46.99,60.96 47.62,60.96 49.53,62.87 49.53,105.41 55.24,111.12 55.24,122.56 62.87,130.18 85.09,130.18 87.63,127.64 87.63,114.94 85.09,112.39 E8.3
  Bottom 0.406: E10.10 57.78,45.72 57.15,46.35 57.15,55.24 51.44,60.96 v46.99,60.96
N$9
  Bottom 0.406: E4.4 66.04,21.59 66.04,26.67 74.93,26.67 E12.9
N$10
  Top 0.406: D1.A 24.13,6.35 24.13,13.97 E17.2
N$11
  Bottom 0.406: D2.A D1.C
N$12
  Top 0.406: Q12.2 100.97,38.73 100.97,36.83 98.42,34.29 88.9,34.29 88.9,18.41 84.45,13.97 82.55,13.97 82.55,11.43 R37.1
  Bottom 0.406: D2.C 85.09,6.35 R37.1
N$13  (via drill 0.81)
  Top 0.406: v99.06,31.11 99.06,23.5 101.6,20.95 E1.3
  Bottom 0.406: R16.1 85.72,34.29 87,35.56 88.27,35.56 89.53,34.29 95.89,34.29 97.16,33.02 97.16,32.38 97.79,31.75 98.42,31.75 v99.06,31.11
N$14
  Top 0.406: E12.8 76.2,39.37 R18.1
N$15
  Top 0.406: E12.6 80.64,28.57 80.64,43.81 R20.1
N$16  (via drill 0.81)
  Top 0.406: R22.1 77.47,51.44 73.03,46.99 73.03,34.92 71.12,33.02 71.12,29.84 69.85,28.57 69.85,10.79 68.58,9.53 68.58,4.45 64.77,0.64 22.86,0.64 v22.86,10.79
  Bottom 0.406: v22.86,10.79 27.94,15.88 27.94,22.86 27.3,22.86 24.77,25.4 E17.6
N$17  (via drill 0.81)
  Top 0.406: R24.1 77.47,60.33 74.93,62.87 v74.93,105.41
  Bottom 0.406: v74.93,105.41 78.11,105.41 79.38,106.68 81.92,106.68 82.55,107.31 82.55,109.22 E8.2
N$18
  Top 0.406: R26.1 78.74,80.01 78.74,80.64 80.01,81.92 80.01,97.16 83.82,100.97 83.82,113.03 E8.4
N$19  (via drill 0.81)
  Top 0.406: R28.1 77.47,73.03 80.01,75.56 80.01,80.64 81.28,81.92 81.28,97.16 85.72,101.6 88.27,101.6 88.9,102.23 v88.9,119.38
  Bottom 0.406: E8.6 v88.9,119.38
N$20
  Top 0.406: R30.1 76.2,67.31 76.2,103.5 78.74,106.05 78.74,112.39 78.11,113.03 76.2,113.03 76.2,120.02 77.47,121.28 E8.8
N$21
  Bottom 0.406: R32.1 86.36,93.98 86.36,110.49 78.74,110.49 E8.12
N$22
  Bottom 0.406: E2.6 20.32,116.84 20.32,106.68 20.95,106.68 24.77,102.87 54.61,102.87 55.88,101.6 61.59,101.6 66.04,97.16 66.04,87.63 69.22,87.63 72.39,90.81 72.39,95.25 78.11,95.25 78.74,94.61 78.74,91.44 R36.1
N$23
  Bottom 0.406: R36.2 R35.1 91.44,97.79 105.41,97.79 105.41,92.08 104.78,91.44 102.87,91.44 Q1.2
N$24
  Top 0.406: R34.1 80.01,102.87 80.01,113.67 77.47,116.2 E8.10
N$25
  Bottom 0.406: R34.2 87.63,99.06 | 87.63,99.06 R33.1 | 87.63,99.06 Q2.2
N$26
  Bottom 0.406: R32.2 R31.1 88.9,87.63 Q3.2
N$27
  Bottom 0.406: R30.2 R29.1 95.25,68.58 Q4.2
N$28
  Bottom 0.406: R28.2 R27.1 Q5.2
N$29
  Top 0.406: Q6.2 92.71,78.74 92.71,79.38 90.81,81.28 R25.1
  Bottom 0.406: R25.1 R26.2
N$30
  Top 0.406: Q7.2 92.71,59.69 92.71,60.33 90.81,62.23 R23.1
  Bottom 0.406: R23.1 R24.2
N$31
  Bottom 0.406: R22.2 R21.1 Q8.2
N$32
  Bottom 0.406: R20.2 R19.1 89.53,49.53 90.81,50.8 99.06,50.8 Q9.2
N$33
  Bottom 0.406: R18.2 R17.1 91.44,43.18 Q10.2
N$34
  Top 0.406: R15.1 R16.2
  Bottom 0.406: Q11.2 88.9,36.83 R15.1
N$35  (via drill 0.81)
  Top 0.406: v20.32,34.92 17.78,37.47 17.78,41.91 16.51,43.18 16.51,48.9 15.24,50.16 E3.8
  Bottom 0.406: E17.1 19.68,12.7 19.05,13.34 19.05,30.48 18.41,30.48 17.78,31.11 17.78,32.38 v20.32,34.92
N$36  (via drill 0.81)
  Top 0.406: E2.5 23.5,116.84 28.57,121.92 v29.84,121.92
  Bottom 0.406: E5.8 v29.84,121.92
N$37
  Bottom 0.406: E5.9 39.37,120.65 58.42,120.65 E6.8
N$38
  Top 0.406: E7.12 58.42,87.63 58.42,89.53 59.05,90.17 66.04,90.17 66.04,95.25 E7.7
N$39
  Top 0.406: E6.2 62.23,104.14 62.23,93.98 E7.10
  Bottom 0.406: E7.13 58.42,85.09 58.42,91.44 E7.10
N$40
  Top 0.406: E11.1 44.45,60.96 44.45,62.87 45.09,63.5 46.99,63.5 46.99,68.58 E11.5 44.45,71.12 44.45,75.56 45.72,76.83 E13.1 | E2.2 21.59,107.95 21.59,100.97 20.32,99.69 20.32,96.52 E14.6
  Bottom 0.406: 46.99,107.95 46.35,107.31 | 46.35,107.31 E5.1 | 46.99,107.95 46.99,116.84 E5.5 | E7.5 68.58,92.71 68.58,103.5 55.24,103.5 51.44,107.31 46.35,107.31 | E2.2 21.59,110.49 21.59,113.03 26.04,113.03 31.11,107.95 46.99,107.95 | E9.1 68.58,60.96 68.58,69.85 | 68.58,69.85 E9.5 64.14,73.03 64.14,78.11 62.23,80.01 46.99,80.01 E13.1 43.18,83.82 43.18,85.09 | E7.1 68.58,81.28 69.85,80.01 69.85,69.85 68.58,69.85 | 43.18,85.09 43.18,91.44 E13.5 | E14.6 21.59,92.71 21.59,85.09 43.18,85.09
N$41
  Top 0.406: E11.2 47.62,62.23 47.62,62.87 48.26,63.5 48.26,69.85 E11.6 46.99,73.66 46.99,82.55 E13.2 46.99,85.09 46.99,95.25 | E9.2 66.04,63.5 66.04,71.12 E9.6 | E7.6 68.58,92.71 68.58,85.09 E7.2 | E3.6 20.32,50.8 20.32,83.82 E14.3 | E5.2 46.99,107.95 46.99,95.25 | E13.6 46.99,95.25
  Bottom 0.406: E13.2 46.99,82.55 60.33,82.55 63.5,85.72 65.41,85.72 66.04,85.09 | E7.2 66.04,85.09 | E9.6 68.58,73.66 68.58,80.01 66.67,80.01 66.04,80.64 66.04,85.09 | E5.2 44.45,110.49 37.47,110.49 36.2,109.22 31.11,109.22 26.04,114.3 E2.4 | E13.6 44.45,92.71 41.27,92.71 38.73,90.17 26.67,90.17 E14.3
N$42  (via drill 0.81)
  Top 0.406: E7.3 67.31,85.72 62.87,81.28 62.87,80.64 62.23,80.01 62.23,76.83 61.59,76.2 60.33,76.2 59.69,75.56 E9.8 | E6.11 59.69,114.94 64.77,120.02 64.77,121.28 72.39,128.91 85.09,128.91 86.36,127.64 86.36,116.2 85.72,115.57 84.45,115.57 82.55,113.67 82.55,100.97 78.74,97.16 v78.74,82.55
  Bottom 0.406: v78.74,82.55 76.83,82.55 71.12,76.83 71.12,60.33 69.22,58.42 66.67,58.42 63.5,61.59 62.23,61.59 60.33,63.5 59.05,63.5 57.15,65.41 57.15,74.3 57.78,74.93 E9.8
N$43
  Top 0.406: E9.9 58.42,73.66 58.42,80.01 E7.14
N$44
  Top 0.406: E10.8 59.69,57.78 60.96,59.05 60.96,60.96 E9.13 | E9.10 57.15,67.31 TP1.1
  Bottom 0.406: TP1.1 E9.13
N$45  (via drill 0.81)
  Top 0.406: E9.7 64.77,72.39 64.77,60.96 v63.5,59.69
  Bottom 0.406: v63.5,59.69 63.5,60.33 60.96,60.33 60.33,60.96 59.05,60.96 57.78,59.69 56.52,59.69 53.34,62.87 53.34,73.66 55.24,73.66 57.78,76.2 60.33,76.2 61.59,74.93 61.59,72.39 60.33,71.12 59.05,71.12 58.42,70.48 58.42,65.41 59.05,64.77 E9.12
N$46
  Top 0.406: E13.13 39.37,82.55 39.37,80.64 36.83,78.11 36.83,71.12 E11.10 39.37,68.58 39.37,67.31 41.27,65.41 41.27,58.42 46.35,58.42 50.8,62.87 50.8,71.12 60.33,71.12 62.23,69.22 62.23,45.72 E10.11
N$47  (via drill 0.81)
  Top 0.406: v40.64,67.94 40.64,83.19 38.1,85.72 E13.12
  Bottom 0.406: E11.7 45.09,74.3 43.81,74.3 41.91,72.39 41.91,69.22 v40.64,67.94
N$48  (via drill 0.81)
  Top 0.406: E9.3 67.31,64.14 68.58,62.87 68.58,57.78 64.77,53.98 v64.77,39.37 64.77,37.47 64.14,36.83 64.14,15.24 55.88,6.99 55.88,1.91 v31.11,1.91
  Bottom 0.406: v64.77,39.37 65.41,39.37 66.67,38.1 E10.2 | E11.13 34.92,62.23 27.94,69.22 27.94,76.83 29.84,76.83 30.48,77.47 30.48,79.38 26.67,79.38 23.5,82.55 22.23,82.55 19.05,85.72 19.05,92.08 18.41,92.08 17.78,92.71 14.61,92.71 12.06,90.17 10.16,90.17 1.91,81.92 1.91,1.91 v31.11,1.91
N$49
  Top 0.406: E9.14 48.9,59.69 46.35,57.15 40.64,57.15 40.64,52.7 40.01,52.07 36.83,52.07 36.83,63.5 E11.12
N$50
  Bottom 0.406: E10.5 62.23,50.8 62.23,58.42 56.52,58.42 46.35,68.58 43.18,68.58 40.64,66.04 37.47,66.04 33.02,70.48 8/5H.1 36.83,73.66 E11.8
N$51
  Bottom 0.406: E11.9 39.37,73.66 39.37,76.2 31.75,76.2 8/5L.1
N$52
  Top 0.406: E13.8 35.56,93.98 35.56,48.9 33.02,46.35 TP2.1
  Bottom 0.406: E13.3 44.45,87.63 44.45,90.17 46.35,90.17 46.99,90.81 46.99,95.25 39.37,95.25 E13.8 | E4.5 68.58,21.59 68.58,19.05 62.87,19.05 60.33,21.59 55.88,21.59 53.34,19.05 45.09,19.05 43.81,20.32 43.81,20.95 39.37,25.4 39.37,29.21 TP2.1
N$53
  Top 0.406: E13.14 36.83,82.55 36.83,92.71 E13.9
N$54
  Bottom 0.406: R1.1 107.31,13.34 117.47,13.34 U$2.BS2
N$55
  Top 0.406: E10.3 68.58,39.37 68.58,26.67 E4.6 | E6.3 69.85,109.22 69.85,55.24 68.58,53.98 68.58,49.53 E10.6
  Bottom 0.406: E6.3 E6.12 58.42,111.76 58.42,117.47 59.05,118.11 66.04,118.11 E6.6 | E10.12 60.96,41.91 60.96,44.45 | 60.96,44.45 60.96,48.26 E10.9 | E10.3 68.58,41.91 68.58,44.45 | 68.58,44.45 68.58,48.26 E10.6 | 68.58,44.45 60.96,44.45 | E12.2 80.64,15.24 76.83,19.05 73.66,19.05 E4.6
N$56
  Top 0.406: E7.8 59.69,104.78 66.04,111.12 66.04,115.57 E6.5
N$57
  Bottom 0.406: E12.3 92.08,17.78 93.34,16.51 94.61,16.51 96.52,14.61 R1.2 R2.1
N$58
  Bottom 0.406: R11.1 109.22,10.16 117.47,10.16 U$2.BT2
N$59
  Top 0.406: E12.1 95.25,12.7 95.25,8.89 R11.2
  Bottom 0.406: R11.2 R12.1
N$60
  Top 0.406: E15.14 36.83,13.97 36.83,24.13 | 36.83,24.13 36.83,26.67 E15.8 | E4.11 59.05,20.95 59.05,21.59 58.42,22.23 58.42,36.2 56.52,38.1 48.26,38.1 48.26,32.38 40.01,24.13 36.83,24.13
  Bottom 0.406: E4.11 62.23,17.78 E4.3
N$61
  Top 0.406: E14.10 12.7,93.98 12.7,116.84 E2.9
  Bottom 0.406: E3.5 19.68,45.72 15.88,41.91 14.61,41.91 11.43,45.09 11.43,87.63 15.88,87.63 16.51,88.27 16.51,91.44 E14.10
N$62
  Top 0.406: E18.14 36.83,36.83 36.83,46.99 E18.9 40.64,45.72 40.64,41.91 42.55,41.91 43.18,42.55 43.18,47.62 45.09,49.53 46.35,49.53 46.99,50.16 46.99,50.8 48.9,50.8 52.07,47.62 52.07,41.91 60.33,41.91 60.96,41.27 60.96,34.92 59.69,33.66 E4.8
N$63
  Top 0.406: TP6.1 46.99,46.99 46.99,34.92 38.1,26.04 E15.9
  Bottom 0.406: TP6.1 E18.7 | E15.9 42.55,20.95 42.55,17.78 E15.3
N$64
  Bottom 0.406: E4.1 71.12,8.89 87,8.89 87.63,8.26 87.63,3.81 90.81,3.81 95.89,8.89 99.69,8.89 100.33,9.53 100.33,17.78 E1.2
N$65  (via drill 0.81)
  Top 0.406: E13.7 45.72,102.23 43.18,104.78 43.18,116.2 45.09,118.11 46.35,118.11 46.99,118.75 v46.99,125.73 46.99,131.44 85.09,131.44 94.61,121.92 94.61,116.2 96.52,114.3 R9.1
  Bottom 0.406: R9.1 97.79,111.76 99.69,113.67 99.69,114.3 R10.1 | 8/5L.3 29.21,97.16 32.38,97.16 33.02,97.79 41.91,97.79 43.18,96.52 E13.7 | E2.13 12.7,111.76 12.7,123.83 15.24,126.36 19.68,126.36 20.95,127.64 22.86,127.64 23.5,127 35.56,127 36.83,125.73 v46.99,125.73
N$66  (via drill 0.81)
  Top 0.406: E11.3 43.18,67.31 v43.18,80.01
  Bottom 0.406: v43.18,80.01 40.64,82.55 37.47,82.55 36.2,83.82 8/5H.2
N$67  (via drill 0.81)
  Top 0.406: 8/5L.2 v29.21,78.11
  Bottom 0.406: E11.14 36.2,59.69 26.67,69.22 26.67,78.11 v29.21,78.11
N$68  (via drill 0.81)
  Top 0.406: E14.8 15.88,96.52 17.78,98.42 17.78,110.49 20.32,113.03 20.32,116.2 22.23,118.11 23.5,118.11 v28.57,123.19
  Bottom 0.406: v28.57,123.19 63.5,123.19 66.04,120.65 96.52,120.65 97.79,119.38 99.06,119.38 | R6.1 99.06,119.38 | 99.06,119.38 R5.2
N$69
  Bottom 0.406: R9.2 117.47,111.76 U$2.AF2
N$70  (via drill 0.81)
  Top 0.406: v74.93,2.54 74.93,13.34 75.56,13.97 75.56,14.61 E12.13
  Bottom 0.406: E13.10 36.2,91.44 34.92,92.71 | 34.92,92.71 33.66,93.98 8/5H.3 | E2.12 16.51,110.49 16.51,108.58 15.88,107.95 | 15.88,107.95 12.7,107.95 0.64,95.89 0.64,0.64 31.75,0.64 33.66,2.54 v74.93,2.54 | 34.92,92.71 28.57,92.71 22.86,98.42 22.86,100.33 16.51,106.68 16.51,107.31 15.88,107.95
N$71  (via drill 0.81)
  Top 0.406: v95.89,109.86 95.89,108.58 96.52,107.95 R13.1
  Bottom 0.406: R14.1 99.06,109.22 97.16,107.31 97.16,106.68 R13.1 | E6.9 59.05,119.38 55.88,116.2 55.88,111.12 56.52,111.12 57.15,110.49 73.03,110.49 75.56,113.03 85.72,113.03 87,111.76 93.98,111.76 v95.89,109.86
N$72
  Bottom 0.406: R5.1 107.95,118.11 117.47,118.11 U$2.AD2
N$73  (via drill 0.81)
  Top 0.406: TP5.1 13.97,31.75 13.97,22.23 14.61,21.59 15.88,21.59 16.51,20.95 16.51,19.68 15.88,19.05 14.61,19.05 12.7,17.14 12.7,4.45 13.34,3.81 16.51,3.81 21.59,8.89 21.59,16.51 | 21.59,16.51 21.59,18.41 22.23,19.05 26.04,19.05 33.66,11.43 38.73,11.43 39.37,12.06 39.37,13.34 38.1,14.61 E15.13 | E14.2 22.86,83.19 21.59,81.92 21.59,55.24 24.13,52.7 24.13,45.09 23.5,44.45 22.23,44.45 21.59,43.81 21.59,41.27 20.32,40.01 v20.32,36.83 | v50.8,17.78 50.8,13.97 43.81,6.99 42.55,6.99 40.64,8.89 33.66,8.89 26.04,16.51 21.59,16.51
  Bottom 0.406: E4.2 62.87,15.24 60.33,17.78 E4.12 v50.8,17.78 | v20.32,36.83 17.78,34.29 17.78,33.66 17.14,33.02 TP5.1
N$74  (via drill 0.81)
  Top 0.406: v31.11,120.65 31.11,122.56 29.21,124.46 23.5,124.46 20.95,121.92 E2.8
  Bottom 0.406: E5.6 43.18,119.38 41.91,118.11 37.47,118.11 34.92,120.65 v31.11,120.65
N$75
  Top 0.406: E15.1 44.45,13.97 44.45,21.59 E15.5 | E18.5 44.45,44.45 44.45,36.83 E18.1
  Bottom 0.406: E3.1 24.13,36.83 24.13,38.73 23.5,39.37 19.68,39.37 17.14,36.83 14.61,36.83 10.79,33.02 10.79,3.81 20.95,3.81 23.5,6.35 33.66,6.35 35.56,8.26 49.53,8.26 55.24,13.97 | 55.24,13.97 55.88,14.61 55.88,16.51 49.53,16.51 E15.1 | E12.4 82.55,19.05 82.55,16.51 84.45,16.51 85.09,15.88 85.09,13.97 55.24,13.97 | E18.1 45.72,34.29 48.26,31.75 48.26,22.86 E15.5
N$76
  Bottom 0.406: 1.5|2.0-1.0.2 E4.9
N$77  (via drill 0.81)
  Top 0.406: R3.2 v13.97,16.51
  Bottom 0.406: R3.2 19.05,5.08 21.59,7.62 R4.1 | E17.9 13.97,24.13 v13.97,16.51
N$78
  Bottom 0.406: R3.1 25.4,3.81 86.36,3.81 87.63,2.54 106.05,2.54 107.31,3.81 117.47,3.81 U$2.BV2
N$79  (via drill 0.81)
  Top 0.406: v49.53,20.32 49.53,13.97 43.81,8.26 42.55,8.26 40.64,10.16 33.66,10.16 26.04,17.78 E17.3
  Bottom 0.406: E4.10 55.88,22.86 53.34,20.32 v49.53,20.32
N$80  (via drill 0.81)
  Top 0.406: E15.2 45.72,15.88 46.99,17.14 46.99,23.5 45.72,24.77 E15.6 | E3.2 21.59,36.83 21.59,33.66 19.05,31.11 | 19.05,31.11 16.51,28.57 15.24,28.57 E17.8 | E14.9 15.24,93.34 16.51,92.08 16.51,90.81 17.78,89.53 17.78,56.52 | 17.78,56.52 19.05,55.24 v19.05,54.61 | 19.05,31.11 v19.05,31.75 19.05,34.92 16.51,37.47 16.51,41.27 15.88,41.91 14.61,41.91 13.97,42.55 13.97,52.7 17.78,56.52
  Bottom 0.406: E18.2 43.81,38.1 42.55,36.83 37.47,36.83 36.83,36.2 36.83,34.29 | 36.83,34.29 42.55,34.29 43.81,33.02 45.72,33.02 46.99,31.75 46.99,25.4 E15.6 | v19.05,54.61 40.01,54.61 41.91,52.7 41.91,48.26 E18.6 | 36.83,34.29 35.56,33.02 19.68,33.02 19.05,32.38 v19.05,31.75
N$81  (via drill 0.81)
  Top 0.406: v50.16,40.64 50.8,41.27 1.5.1 | 1.0|2.0.2 26.67,38.73 30.48,42.55 v30.48,48.9
  Bottom 0.406: 1.5.1 49.53,44.45 41.91,44.45 40.64,45.72 E18.10 33.66,45.72 v30.48,48.9 | v50.16,40.64 E18.3
N$82
  Bottom 0.406: E18.12 39.37,39.37 46.99,39.37 1.5.2 1.5|2.0-1.0.1
N$83  (via drill 0.81)
  Top 0.406: v33.66,22.86 24.77,22.86 22.86,20.95 E17.4
  Bottom 0.406: v33.66,22.86 E15.10
N$84  (via drill 0.81)
  Top 0.406: E4.13 57.78,17.14 57.78,21.59 57.15,22.23 57.15,24.13 55.88,25.4 v55.88,36.83
  Bottom 0.406: v55.88,36.83 50.8,41.91 20.95,41.91 18.41,39.37 13.34,39.37 10.16,42.55 10.16,88.9 E14.11
N$85
  Top 0.406: R8.1 24.77,57.78 24.77,82.55 27.94,85.72 27.94,99.69 29.21,100.97 29.21,105.41 C20.2
  Bottom 0.406: C20.2 E2.1
N$86  (via drill 0.81)
  Top 0.406: v13.97,76.2 13.97,78.74 12.7,80.01 12.7,91.44 10.16,93.98 10.16,116.2 12.7,118.75 12.7,122.56 17.14,127 27.94,127 32.38,122.56 32.38,109.86 31.75,109.22 C19.2
  Bottom 0.406: E2.3 24.77,111.76 31.11,105.41 C19.2 | R7.1 15.24,77.47 v13.97,76.2
N$87
  Top 0.406: E14.4 24.13,90.17 24.13,100.33 25.4,101.6 C20.1
N$88  (via drill 0.81)
  Top 0.406: v25.4,99.69 25.4,84.45 22.86,81.92 E14.1
  Bottom 0.406: C19.1 29.21,100.33 28.57,99.69 v25.4,99.69
N$89  (via drill 0.81)
  Top 0.406: v20.32,9.53 20.32,22.86 21.59,24.13 21.59,28.57 23.5,30.48 26.04,30.48 26.67,29.84 1.0|2.0.1
  Bottom 0.406: E17.12 16.51,16.51 16.51,11.43 17.14,11.43 18.41,10.16 19.68,10.16 v20.32,9.53
N$90  (via drill 0.81)
  Top 0.406: v29.21,50.16 29.21,42.55 25.4,38.73 25.4,36.2 17.78,28.57 17.78,18.41 15.24,15.88 E17.13
  Bottom 0.406: E18.8 29.84,50.8 v29.21,50.16
N$91  (via drill 0.81)
  Top 0.406: E14.5 22.86,92.08 21.59,93.34 21.59,93.98 19.68,95.89 19.05,95.89 | 19.05,95.89 16.51,95.89 15.88,95.25 14.61,95.25 13.97,95.89 13.97,99.69 15.24,100.97 TP3.1 | v31.75,43.81 31.75,51.44 34.29,53.98 34.29,100.97 30.48,104.78 30.48,106.05 26.04,110.49 22.23,110.49 20.32,108.58 20.32,107.31 19.05,106.05 19.05,95.89
  Bottom 0.406: E3.12 18.41,40.64 22.23,44.45 31.11,44.45 v31.75,43.81
N$92  (via drill 0.81)
  Top 0.406: E5.14 38.1,107.31 40.01,109.22 40.01,111.12 41.91,113.03 41.91,116.2 43.18,117.47 43.18,118.75 45.72,121.28 E5.7 | E7.9 59.69,94.61 58.42,95.89 58.42,97.16 v50.8,104.78
  Bottom 0.406: v50.8,104.78 43.18,104.78 41.27,106.68 E5.14
N$93  (via drill 0.81)
  Top 0.406: E15.7 45.72,27.3 43.18,24.77 v43.18,9.53
  Bottom 0.406: v43.18,9.53 37.47,9.53 36.83,10.16 24.13,10.16 23.5,9.53 22.23,9.53 20.32,11.43 18.41,11.43 17.78,12.06 17.78,22.86 E17.10
N$94
  Top 0.406: E14.12 13.97,85.09 13.97,80.01 15.24,78.74 15.24,75.56 14.61,74.93 8.89,74.93 8.89,120.02 17.14,128.27 39.37,128.27 39.37,113.03 E5.12
  Bottom 0.406: TP4.1 33.02,110.49 36.2,110.49 37.47,111.76 E5.12
N$95
  Top 0.406: E17.11 13.34,20.32 13.34,21.59 12.7,22.23 12.7,33.66 | 12.7,33.66 14.61,35.56 E3.14 | E14.13 16.51,82.55 16.51,56.52 12.7,52.7 12.7,33.66
  Bottom 0.406: E3.3 23.5,40.64 25.4,38.73 25.4,34.29 22.23,34.29 21.59,34.92 21.59,38.1 19.68,38.1 17.14,35.56 E3.14
N$96
  Top 0.406: E12.12 73.66,15.24 73.66,1.91 74.3,1.27 101.6,1.27 E1.1
RRUN
  Bottom 0.406: Q12.3 109.86,29.84 117.47,29.84 U$2.BL2
STROBEF
  Bottom 0.406: Q2.3 100.33,100.33 104.14,100.33 111.12,93.34 117.47,93.34 U$2.AN2
VCC  (via drill 0.81)
  Top 0.813: C11.1 44.45,80.64 43.81,81.28 43.81,86.36 44.45,87 44.45,87.63 E13.4 | C5.1 36.2,117.47 38.1,117.47 E5.10 | v34.92,125.73 34.92,119.38 35.56,118.75 C5.1 | C13.1 44.45,101.6 42.55,103.5 39.37,103.5 33.66,109.22 33.66,114.3 35.56,116.2 C5.1 | C9.1 66.04,75.56 63.5,73.03 v63.5,67.31 | E7.4 67.31,88.27 64.14,85.09 v64.14,84.45 | v66.04,105.41 C7.1 | E6.14 59.69,107.31 56.52,110.49 56.52,121.92 59.05,124.46 C6.1 60.96,126.36 v62.87,126.36 | v73.66,97.79 73.66,106.05 74.3,106.68 76.2,106.68 76.83,106.05 E8.14 | R6.2 91.44,121.28 88.9,123.83 v88.9,125.73 | E5.3 46.99,110.49 v49.53,110.49 | E12.14 76.83,13.34 76.83,13.97 78.11,15.24 78.11,27.94 77.47,28.57 C12.1 | E1.14 97.16,18.41 97.16,29.84 95.25,31.75 C1.1 | C4.1 60.96,29.21 62.87,27.3 62.87,16.51 59.69,13.34 E4.14 59.05,12.06 55.24,12.06 52.7,14.61 v52.7,21.59 | E3.4 24.13,43.18 26.04,45.09 v26.04,55.88 26.04,76.83 26.67,77.47 26.67,80.01 v27.3,80.64 | v58.42,53.34 55.88,55.88 45.72,55.88 44.45,54.61 C18.1 44.45,51.44 43.81,50.8 43.81,50.16 41.91,48.26 v41.91,43.18 | v10.79,91.44 11.43,90.81 11.43,79.38 12.7,78.11 R7.2 | v12.06,20.95 11.43,21.59 11.43,53.34 12.7,54.61 R8.2
  Bottom 0.813: C13.1 45.09,99.06 48.9,95.25 48.9,88.9 E13.4 | E5.3 E5.4 41.91,114.3 39.37,116.84 E5.10 | C2.1 19.68,124.46 21.59,126.36 22.23,126.36 22.86,125.73 v34.92,125.73 | R6.2 90.17,119.38 R10.2 93.34,114.3 93.98,114.94 96.52,114.94 97.16,115.57 99.69,115.57 100.33,116.2 102.23,114.3 96.52,108.58 93.98,108.58 93.34,109.22 R14.2 94.61,107.31 94.61,106.68 96.52,104.78 106.68,104.78 107.31,105.41 109.86,105.41 110.49,106.05 117.47,106.05 U$2.AJ2 | E9.4 v63.5,67.31 | v64.14,84.45 64.14,80.01 65.41,78.74 65.41,77.47 C9.1 | E8.14 71.75,106.68 70.48,105.41 68.58,105.41 67.94,104.78 67.31,104.78 66.67,105.41 v66.04,105.41 65.41,105.41 64.14,106.68 E6.14 53.98,106.68 52.07,108.58 51.44,108.58 v49.53,110.49 | v62.87,126.36 66.04,126.36 66.67,125.73 67.94,125.73 68.58,125.09 78.11,125.09 C8.1 80.64,124.46 81.28,125.09 82.55,125.09 83.82,126.36 88.27,126.36 v88.9,125.73 | E7.4 68.58,90.17 69.85,90.17 71.12,91.44 71.12,97.79 v73.66,97.79 | R12.2 89.53,5.71 89.53,10.16 | E1.14 93.34,14.61 93.34,10.16 89.53,10.16 | 89.53,10.16 R2.2 | C1.1 88.27,33.02 87.63,32.38 82.55,32.38 81.28,31.11 80.01,31.11 79.38,30.48 C12.1 76.83,31.11 74.3,31.11 73.66,31.75 66.67,31.75 66.04,32.38 60.96,32.38 | 45.09,20.95 E15.4 | 45.09,20.95 45.09,21.59 42.55,24.13 42.55,30.48 C15.1 | 45.09,20.95 45.72,20.95 46.35,21.59 v52.7,21.59 | 60.96,32.38 61.59,31.75 61.59,30.48 C4.1 | 60.96,32.38 60.33,33.02 59.69,33.02 E10.14 59.05,35.56 51.44,43.18 E18.4 v41.91,43.18 | R4.2 E17.14 12.06,12.7 v12.06,20.95 12.06,26.67 15.88,30.48 C17.1 | E3.10 15.88,45.72 18.41,48.26 18.41,53.34 C3.1 16.51,55.88
  Bottom 0.813: E2.14 15.24,106.05 17.78,103.5 17.78,100.33 C14.1 15.88,99.06 11.43,94.61 11.43,91.44 v10.79,91.44 | E14.14 12.7,81.28 R7.2 R8.2 16.51,55.88 | C18.1 43.18,53.34 40.64,55.88 | 40.64,55.88 v26.04,55.88 24.77,55.88 22.86,57.78 22.23,57.78 20.32,55.88 16.51,55.88 | E11.4 41.27,62.87 41.27,56.52 40.64,55.88 | v58.42,53.34 C10.1 | C11.1 43.81,78.11 43.18,78.11 42.55,78.74 40.01,78.74 39.37,79.38 38.1,79.38 36.83,80.64 v27.3,80.64

### Text on the board
Bottom: TELETYPE RECEIVER W706X | 1-13